# Altium project TL061ACDSubSystemIntroProjectMatthewOwen.PrjPcb
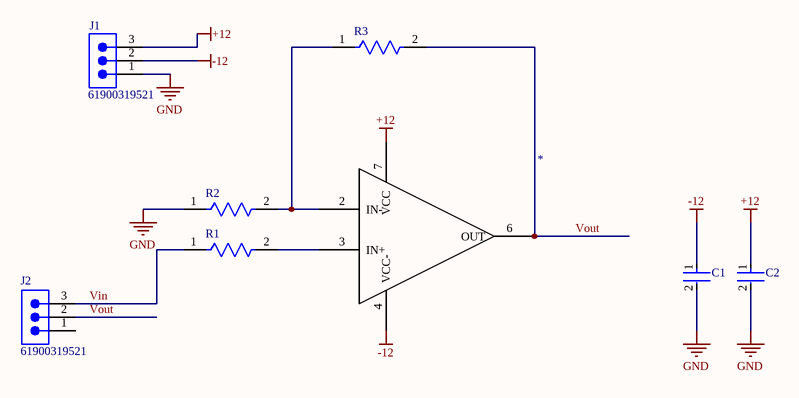
[diagram p0: Subsytemintroductionsychematic.SchDoc]
1 sheet, 8 parts. Net scope: global (net labels, ports and power ports of the same name join across sheets).
Board file: FinalSUbsystemintroDesign.PcbDoc

## Sheet Subsytemintroductionsychematic.SchDoc
size A; SheetNumber: 1; SheetTotal: 1

### Parts
C1  (no value)  [FP-CC0805-0_85-MFG]
C2  (no value)  [FP-CC0805-0_85-MFG]
J1  61900319521  [61900319521]
J2  61900319521  [61900319521]
OpAmp  (no value)  [PCBComponent_1]
R1  (no value)  [FP-RC1005-IPC_A]
R2  (no value)  [FP-RC1005-IPC_A]
R3  (no value)  [FP-RC1005-IPC_A]

### Nets
+12: C2.1 J1.3 OpAmp.7(VCC)
-12: C1.1 J1.2 OpAmp.4(VCC-)
GND: C1.2 C2.2 J1.1 R2.1
Vin: J2.3 R1.1
Vout: J2.2 OpAmp.6(OUT) R3.2
NetOpAmp_2: OpAmp.2(IN-) R2.2 R3.1
NetOpAmp_3: OpAmp.3(IN+) R1.2

Not connected (* = marked no-connect by the designer): J2 1

### Library data of the parts
C1 C2 = CMP-2100-03606-3: CAP CER 0.1UF 50V X7R 0805; Manufacturer Part Number: CC0805KRX7R9BB104; Manufacturer: Yageo; Tolerance: 0.1; Capacitance: 100 nF; Value: 100 nF; Material: Ceramic; Device Class L1: Passive Components; ComponentLink2Description: Datasheet; Package: CC0805-0.85; Digikey Description: CAP CER 0.1UF 50V X7R 0805; Device Class L3: Ceramic Capacitors; Temperature: -30°C to +85°C; Temperature Characteristic: X7R; Voltage Rating: 50 V; Height: 0.95mm; RoHS: TRUE; Ipc Land Pattern Name: CAPC200125X85; Device Class L2: Capacitors; Category: Cap; Temperature Range Low: -30°C; Temperature Range High: +85°C; Mouser Description: Multilayer Ceramic Capacitors MLCC - SMD/SMT 100nF 50V X7R 10%; Footprint Url: http://www.yageo.com/exep/pages/download/literatures/UPY-C_GEN_24.pdf; Automotive: No; Octopart: https://octopart.com/cc0805krx7r9bb104-yageo-192993; Lead Free: Yes; ComponentLink2URL: http://www.yageo.com/documents/recent/UPY-GPHC_Y5V_6.3V-to-50V_8.pdf
J1 J2 = CMP-1502-00600-2: NexarPartId: 18818224; Connector Type: Male Pin; Contact Resistance: 20mΩ; Pitch: 2.54mm; Insulation Resistance: 1GΩ; Number of Contacts: 3; Insulation: Insulated; Gender: Male; Operating Supply Voltage: 250V; Current Rating: 3A; Number of Pins: 3; Min Operating Temperature: -40°C; Color: Beige; Contact Gender: Male; RoHS: Compliant; Max Operating Temperature: 105°C; Height: 3.3mm; Length: 7.62mm; Packaging: Bulk; Width: 7.62mm; Contact Plating: Tin; Lead Pitch: 2.54mm; Number of Rows: 1; Lead Free: Lead Free; Mount: Through Hole; Termination: Through Hole; REACH SVHC: Unknown; Number of Positions: 3; Contact Material: Copper; Contact Mating Length: 7.493mm; Flammability Rating: UL94 V-0; Housing Material: Nylon; Voltage Rating: 250V; Fastening Type: Friction
OpAmp = Component_1
R1-R3 = CMP-13261-004522-1: Res Thick Film 0402 10kΩ 1% 0.063W ±100ppm/°C Molded SMD T/R; Max Power Dissipation: 63mW; Resistance: 10kR; Power Rating: 62.5mW; Package Quantity: 1; Depth: 0.5mm; Radiation Hardening: No; Features: Moisture Resistant; Max Operating Temperature: 155°C; Case Code (Metric): 1005; Military Standard: Not; Case/Package: 0402; Width: 0.02inch; Contact Plating: Tin; Mount: Surface Mount; Packaging: Tape and Reel; Height: 0.016inch; Case Code (Imperial): 0402; Number of Terminations: 2; Composition: Thick Film; Temperature Coefficient: 100ppm/°C; Min Operating Temperature: -55°C; Tolerance: 1%; Length: 1mm